# Altium project SFPextensionSplit.PrjPcb
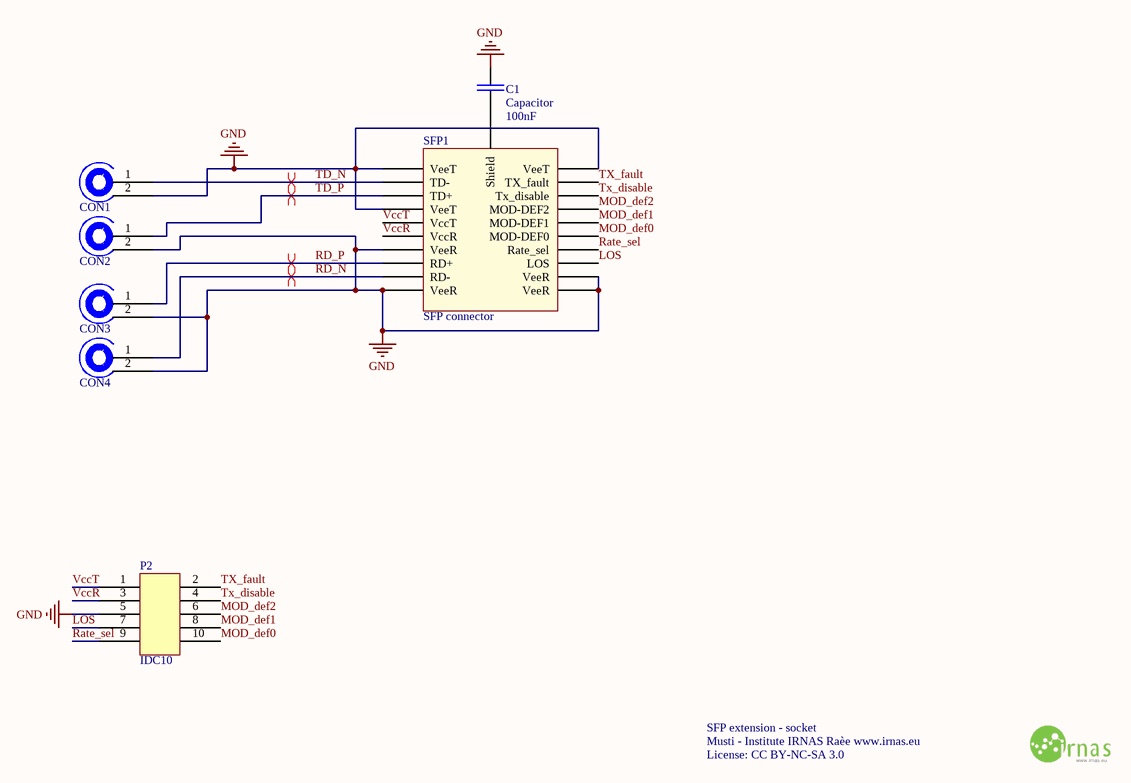
[diagram p0: SFPextensionSplit.SchDoc]
1 sheet, 7 parts. Net scope: global (net labels, ports and power ports of the same name join across sheets).
Board file: SFPextensionSplit.PcbDoc

## Sheet SFPextensionSplit.SchDoc
size A4

### Parts
C1  Capacitor  value 100nF  [RESC2012X06N]
CON1  Coaxial pcb connection  [SMD coaxial connector]  (value not drawn)
CON2  Coaxial pcb connection  [SMD coaxial connector]  (value not drawn)
CON3  Coaxial pcb connection  [SMD coaxial connector]  (value not drawn)
CON4  Coaxial pcb connection  [SMD coaxial connector]  (value not drawn)
P2  IDC10  [IDC10]
SFP1  SFP connector  [SFP receptacle]

### Nets
GND: C1.1 CON1.2(GND) CON2.2(GND) CON3.2(GND) CON4.2(GND) P2.5 SFP1.1(VeeT) SFP1.9(VeeR) SFP1.10(VeeR) SFP1.11(VeeR) SFP1.14(VeeR) SFP1.17(VeeT) SFP1.20(VeeT)
LOS: P2.7 SFP1.8(LOS)
MOD_def0: P2.10 SFP1.6(MOD-DEF0)
MOD_def1: P2.8 SFP1.5(MOD-DEF1)
MOD_def2: P2.6 SFP1.4(MOD-DEF2)
Rate_sel: P2.9 SFP1.7(Rate_sel)
RD_N: CON4.1(SIG) SFP1.12(RD-)
RD_P: CON3.1(SIG) SFP1.13(RD+)
TD_N: CON1.1(SIG) SFP1.19(TD-)
TD_P: CON2.1(SIG) SFP1.18(TD+)
Tx_disable: P2.4 SFP1.3(Tx_disable)
TX_fault: P2.2 SFP1.2(TX_fault)
VccR: P2.3 SFP1.15(VccR)
VccT: P2.1(A) SFP1.16(VccT)
NetC1_2: C1.2 SFP1.21(Shield)

### Layout directives
differential pair: RD_N, RD_P, TD_N, TD_P

### Notes on the sheet
- SFP extension - socket
- Musti - Institute IRNAS Raèe www.irnas.eu
- License: CC BY-NC-SA 3.0

### Library data of the parts
C1 = Capacitor: General capacitor
CON1-CON4 = Coaxial pcb connection: SMD PCB connector for coaxial cabel
P2 = IDC10: IDC 10pin